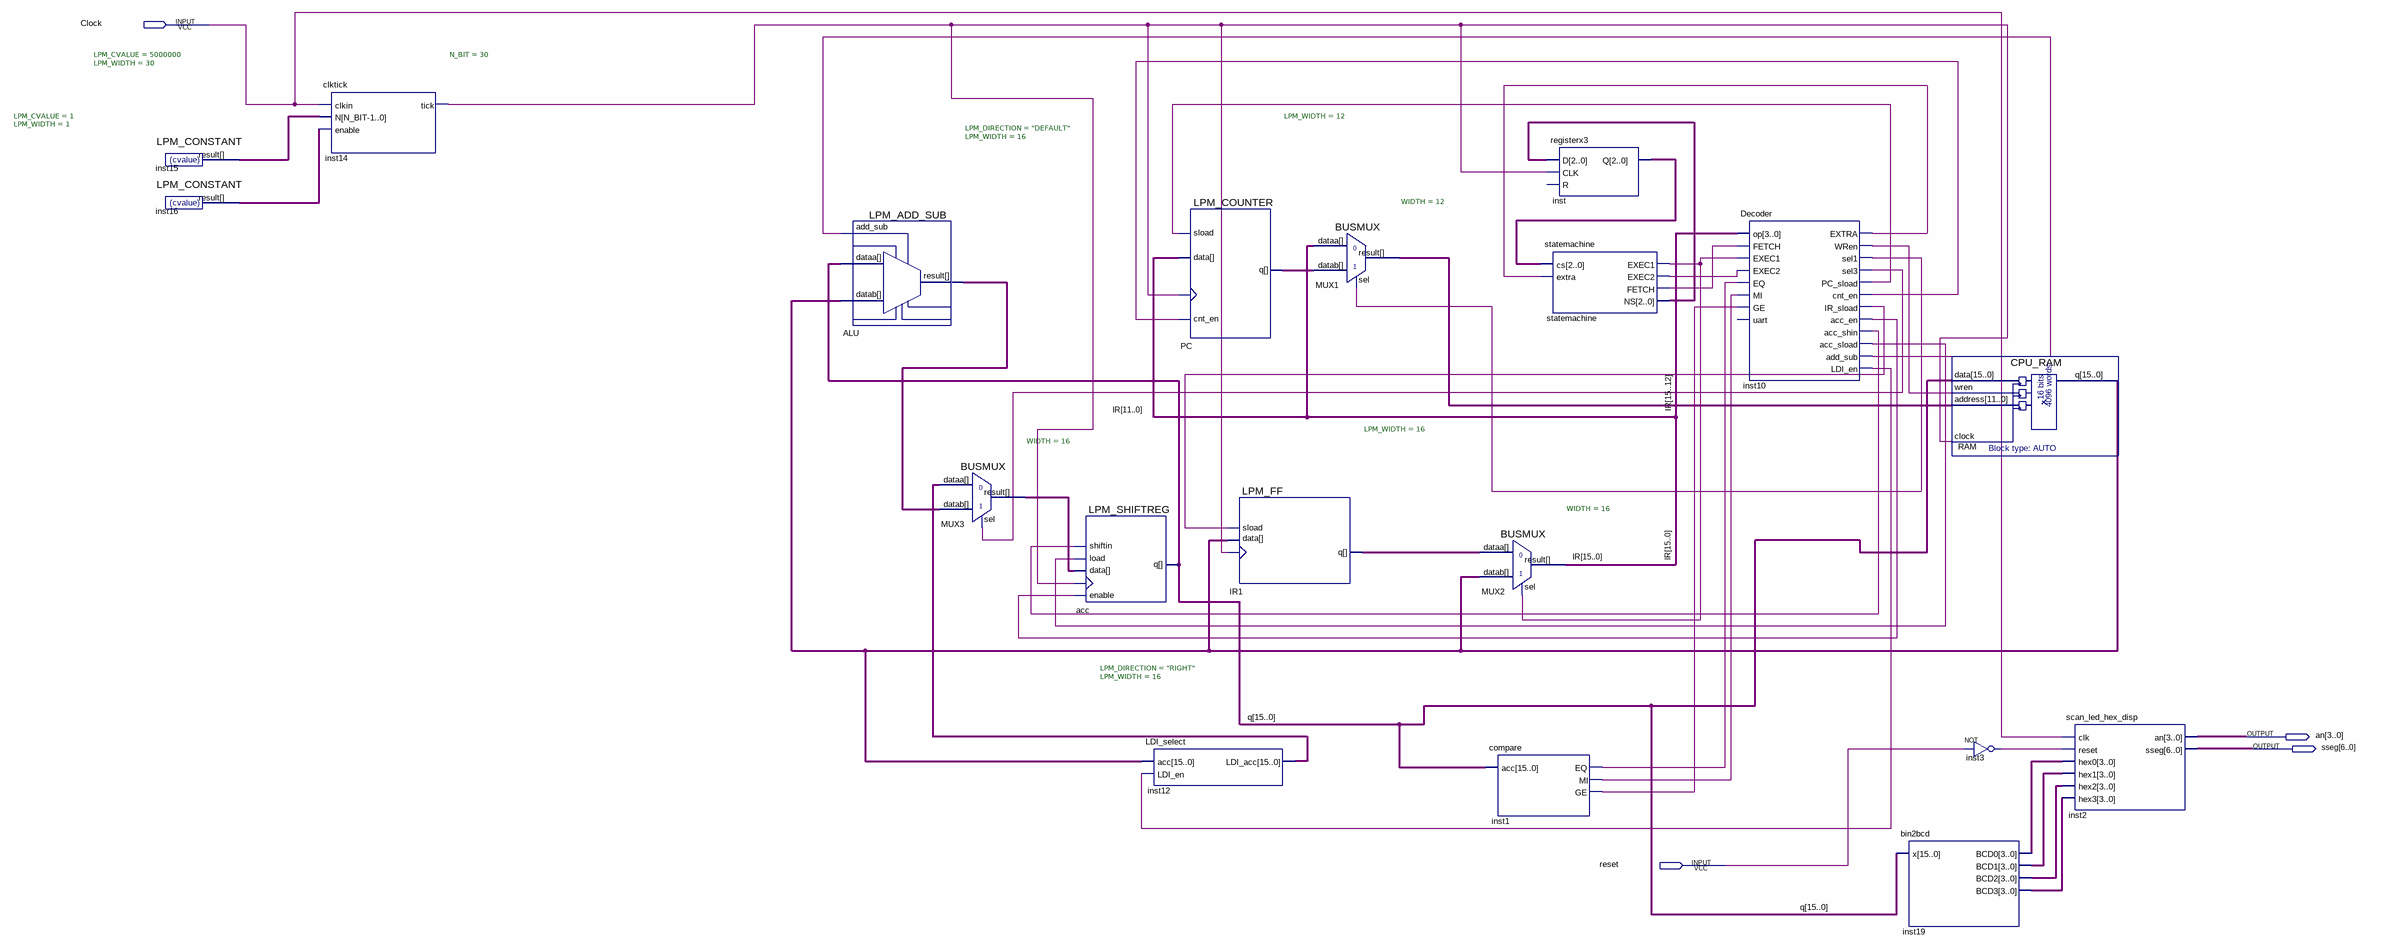
[diagram p0: schematic sheet]
// Quartus schematic CPU_Design.bdf as structural Verilog: 19 symbols, 4 pins
module CPU_Design (
  input  Clock,
  input  reset,
  output [3:0] an,
  output [6:0] sseg
);

  wire inst1_eq, inst1_ge, inst1_mi, inst3_out, inst10_acc_en, inst10_acc_shin, inst10_acc_sload,
       inst10_add_sub, inst10_cnt_en, inst10_extra, inst10_ir_sload, inst10_ldi_en, inst10_pc_sload,
       inst10_sel1, inst10_sel3, inst10_wren, inst14_tick, inst16_result, statemachine_exec1,
       statemachine_exec2, statemachine_fetch;
  wire [2:0] inst_q, statemachine_ns;
  wire [3:0] inst19_bcd0, inst19_bcd1, inst19_bcd2, inst19_bcd3;
  wire [11:0] MUX1_result, PC_q;
  wire [15:0] ALU_result, inst12_ldi_acc, IR, IR1_q, MUX3_result, q, RAM_q;
  wire [29:0] inst15_result;

  LPM_CONSTANT #(.LPM_CVALUE(5000000), .LPM_WIDTH(30)) inst15 (.result(inst15_result));
  LPM_CONSTANT #(.LPM_CVALUE(1), .LPM_WIDTH(1)) inst16 (.result(inst16_result));
  clktick #(.N_BIT(30)) inst14 (.clkin(Clock), .N(inst15_result), .enable(inst16_result), .tick(inst14_tick));
  LPM_ADD_SUB #(.LPM_DIRECTION("DEFAULT"), .LPM_WIDTH(16)) ALU (
    .datab(RAM_q), .add_sub(inst10_add_sub), .dataa(q), .result(ALU_result));
  BUSMUX #(.WIDTH(16)) MUX3 (.datab(ALU_result), .sel(inst10_sel3), .dataa(inst12_ldi_acc), .result(MUX3_result));
  LPM_SHIFTREG #(.LPM_DIRECTION("RIGHT"), .LPM_WIDTH(16)) acc (
    .shiftin(inst10_acc_shin), .enable(inst10_acc_en), .clock(inst14_tick), .data(MUX3_result),
    .load(inst10_acc_sload), .q(q));
  LDI_select inst12 (.acc(RAM_q), .LDI_en(inst10_ldi_en), .LDI_acc(inst12_ldi_acc));
  LPM_COUNTER #(.LPM_WIDTH(12)) PC (
    .sload(inst10_pc_sload), .data(IR[11:0]), .clock(inst14_tick), .cnt_en(inst10_cnt_en), .q(PC_q));
  LPM_FF #(.LPM_WIDTH(16)) IR1 (.clock(inst14_tick), .sload(inst10_ir_sload), .data(RAM_q), .q(IR1_q));
  BUSMUX #(.WIDTH(12)) MUX1 (.datab(PC_q), .sel(inst10_sel1), .dataa(IR[11:0]), .result(MUX1_result));
  BUSMUX #(.WIDTH(16)) MUX2 (.datab(RAM_q), .sel(statemachine_exec1), .dataa(IR1_q), .result(IR));
  compare inst1 (.acc(q), .EQ(inst1_eq), .MI(inst1_mi), .GE(inst1_ge));
  registerx3 inst (.D(statemachine_ns), .CLK(inst14_tick), .Q(inst_q));  // open: R
  statemachine statemachine (
    .cs(inst_q), .extra(inst10_extra), .EXEC1(statemachine_exec1), .EXEC2(statemachine_exec2),
    .FETCH(statemachine_fetch), .NS(statemachine_ns));
  Decoder inst10 (
    .op(IR[15:12]), .FETCH(statemachine_fetch), .EXEC1(statemachine_exec1), .EXEC2(statemachine_exec2),
    .EQ(inst1_eq), .MI(inst1_mi), .GE(inst1_ge), .EXTRA(inst10_extra), .WRen(inst10_wren),
    .sel1(inst10_sel1), .sel3(inst10_sel3), .PC_sload(inst10_pc_sload), .cnt_en(inst10_cnt_en),
    .IR_sload(inst10_ir_sload), .acc_en(inst10_acc_en), .acc_shin(inst10_acc_shin),
    .acc_sload(inst10_acc_sload), .add_sub(inst10_add_sub), .LDI_en(inst10_ldi_en));  // open: uart
  bin2bcd inst19 (.x(q), .BCD0(inst19_bcd0), .BCD1(inst19_bcd1), .BCD2(inst19_bcd2), .BCD3(inst19_bcd3));
  CPU_RAM RAM (.data(q), .wren(inst10_wren), .address(MUX1_result), .clock(inst14_tick), .q(RAM_q));
  not inst3 (inst3_out, reset);
  scan_led_hex_disp inst2 (
    .clk(Clock), .reset(inst3_out), .hex0(inst19_bcd0), .hex1(inst19_bcd1), .hex2(inst19_bcd2),
    .hex3(inst19_bcd3), .an(an), .sseg(sseg));
endmodule
